# EAGLE design rgb_cube_control (EAGLE 5.11)
BOM: EXCLUDE; PARTNO: 114-00841-68

## Sheet 1 of 2
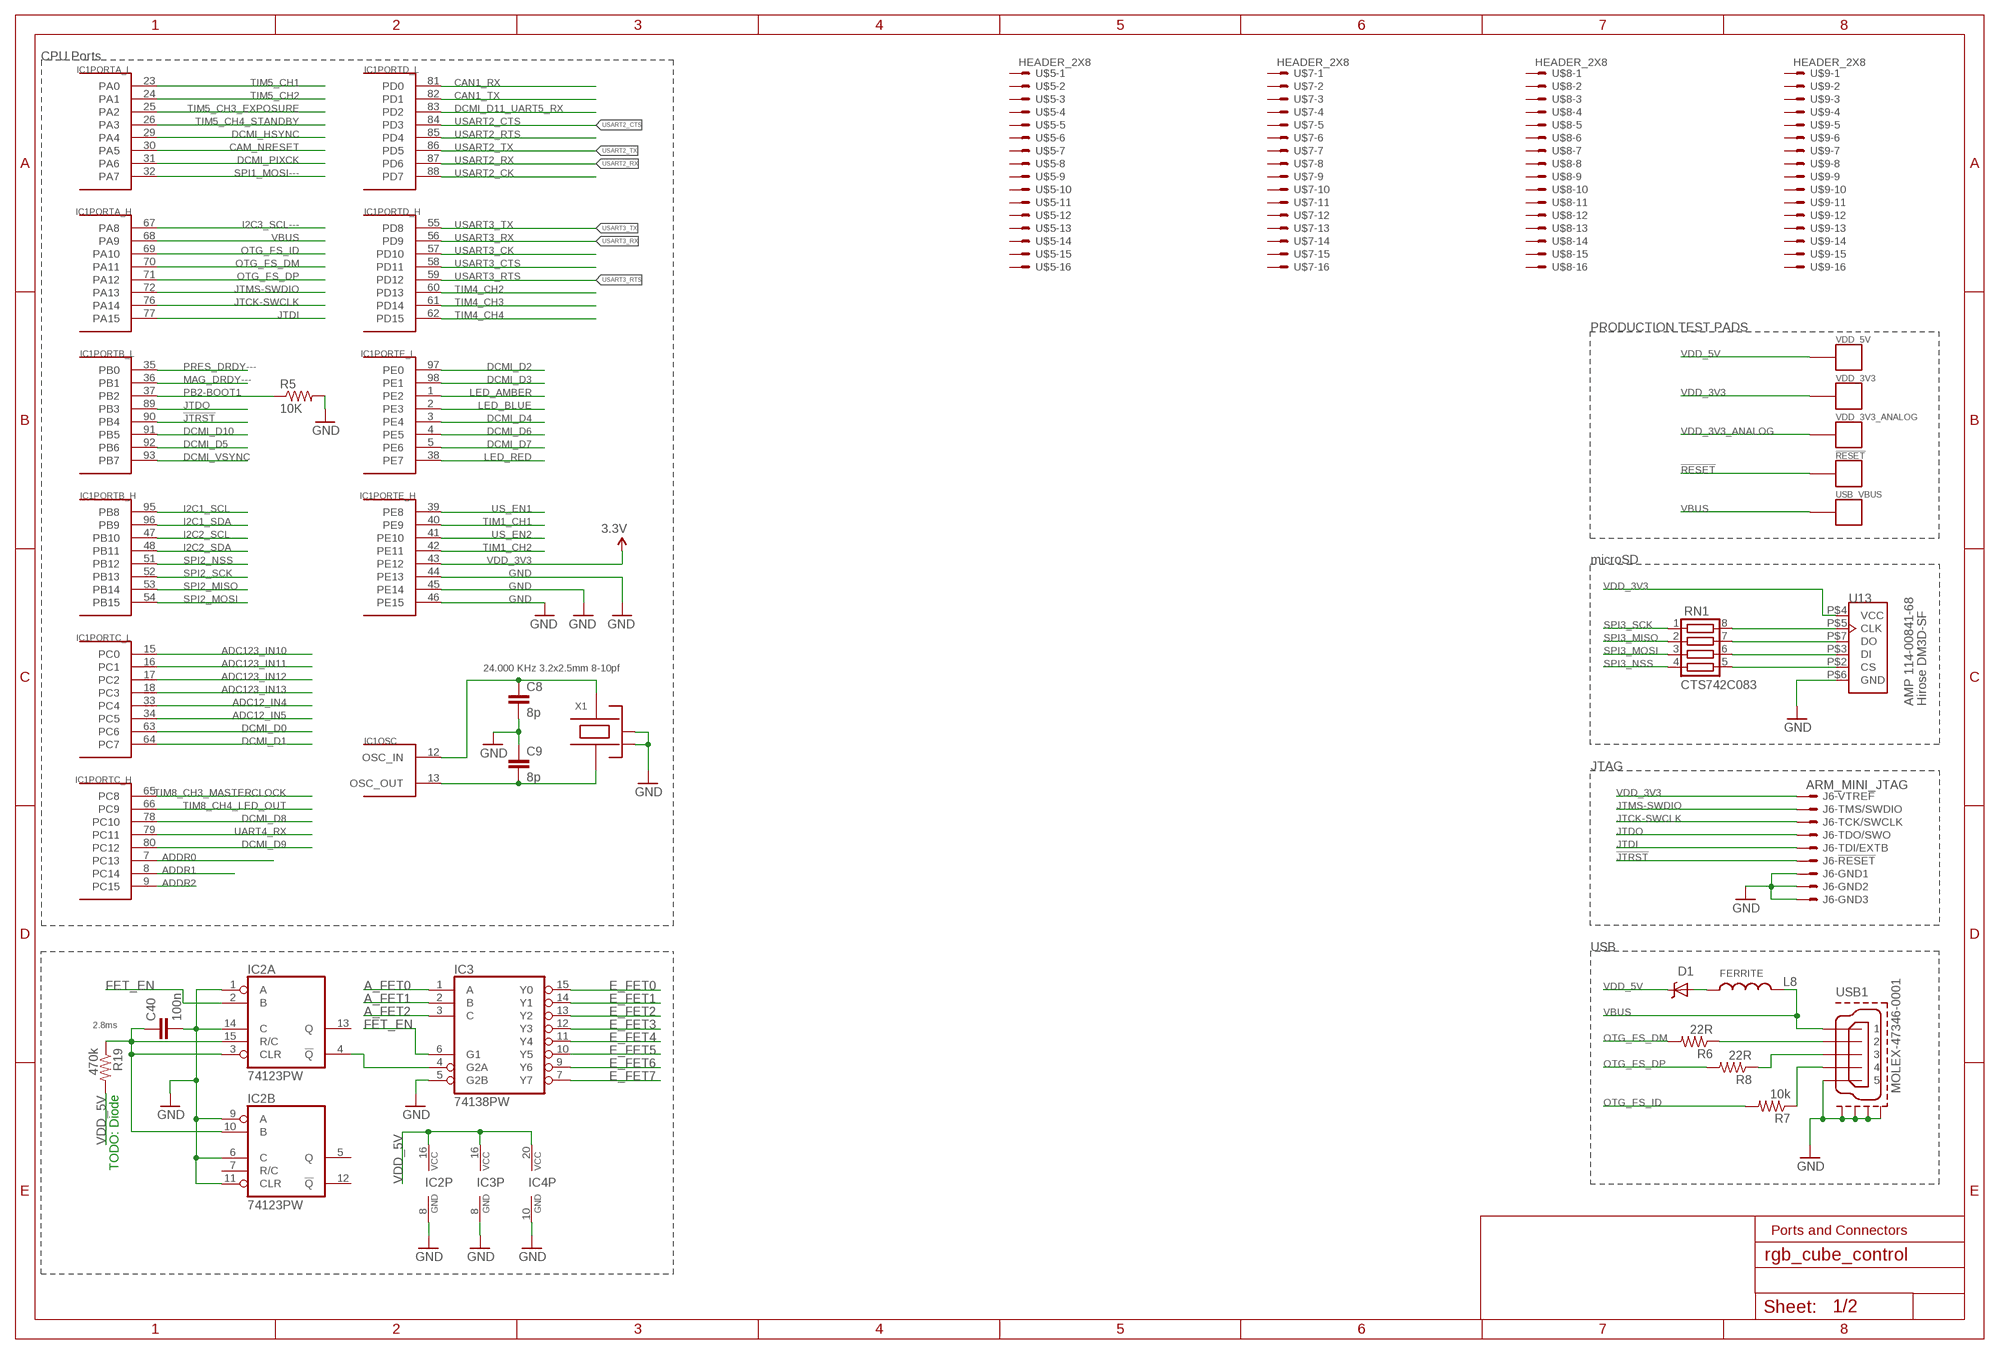
[diagram p0: schematic, sheet 1]

### Parts
!RESET  PAD.04  [PAD.04X.04]
C8  8p  CAP0402-CAP  [0402-CAP]
C9  8p  CAP0402-CAP  [0402-CAP]
C40  100n  C-EUC0402  [C0402]
D1  MSS1P4-M3  DIODE-SCHOTTKY_MSMP  [MICROSMP]
IC1  STM32F4X7VX  [TQFP100]
IC2  74123PW  [TSSOP-16]
IC3  74138PW  [TSSOP-16]
IC4  74540PW  [TSSOP-20]
J6  ARM_MINI_JTAG  ARM_MINI_JTAG-SMT  [FTSH-105-01-XXX-DV-K]
L8  FERRITE  INDUCTOR0402  [0402-IND]
R5  10K  RESISTOR0402-RES  [0402-RES]
R6  22R  RESISTOR0402-RES  [0402-RES]
R7  10k  RESISTOR0402-RES  [0402-RES]
R8  22R  RESISTOR0402-RES  [0402-RES]
R19  470k  RESISTOR  [0805]
RN1  CTS742C083  [CTS742C083]
U13  AMP 114-00841-68  SF-MICROSDAMP-114-00841-68  [AMPHENOL_114-00841-68]
U$5  HEADER_2X8  [HEADER_2MM_2X8]
U$7  HEADER_2X8  [HEADER_2MM_2X8]
U$8  HEADER_2X8  [HEADER_2MM_2X8]
U$9  HEADER_2X8  [HEADER_2MM_2X8]
USB1  MOLEX-47346-0001  [MOLEX-47346-0001]
USB_VBUS  PAD.04  [PAD.04X.04]
VDD_3V3  PAD.04  [PAD.04X.04]
VDD_3V3_ANALOG  PAD.04  [PAD.04X.04]
VDD_5V  PAD.04  [PAD.04X.04]
X1  24.000 KHz 3.2x2.5mm 8-10pf  OSCILLATOR-3.2X2.5  [OSCILLATOR-3.2X2.5]

### Nets
!JTRST: IC1.90(PORTB_L:PB4) J6.10
!RESET [power]: !RESET.P$1 ; also sheet 2
A_FET0: IC3.1(A)
A_FET1: IC3.2(B)
A_FET2: IC3.3(C)
ADC12_IN4: IC1.33(PORTC_L:PC4)
ADC12_IN5: IC1.34(PORTC_L:PC5)
ADC123_IN10: IC1.15(PORTC_L:PC0)
ADC123_IN11: IC1.16(PORTC_L:PC1)
ADC123_IN12: IC1.17(PORTC_L:PC2)
ADC123_IN13: IC1.18(PORTC_L:PC3)
ADDR0: IC1.7(PORTC_H:PC13)
ADDR1: IC1.8(PORTC_H:PC14)
ADDR2: IC1.9(PORTC_H:PC15)
CAM_NRESET: IC1.30(PORTA_L:PA5)
CAN1_RX: IC1.81(PORTD_L:PD0)
CAN1_TX: IC1.82(PORTD_L:PD1)
DCMI_D0: IC1.63(PORTC_L:PC6)
DCMI_D1: IC1.64(PORTC_L:PC7)
DCMI_D2: IC1.97(PORTE_L:PE0)
DCMI_D3: IC1.98(PORTE_L:PE1)
DCMI_D4: IC1.3(PORTE_L:PE4)
DCMI_D5: IC1.92(PORTB_L:PB6)
DCMI_D6: IC1.4(PORTE_L:PE5)
DCMI_D7: IC1.5(PORTE_L:PE6)
DCMI_D8: IC1.78(PORTC_H:PC10)
DCMI_D9: IC1.80(PORTC_H:PC12)
DCMI_D10: IC1.91(PORTB_L:PB5)
DCMI_D11_UART5_RX: IC1.83(PORTD_L:PD2)
DCMI_HSYNC: IC1.29(PORTA_L:PA4)
DCMI_PIXCK: IC1.31(PORTA_L:PA6)
DCMI_VSYNC: IC1.93(PORTB_L:PB7)
E_FET0: IC3.15(Y0)
E_FET1: IC3.14(Y1)
E_FET2: IC3.13(Y2)
E_FET3: IC3.12(Y3)
E_FET4: IC3.11(Y4)
E_FET5: IC3.10(Y5)
E_FET6: IC3.9(Y6)
E_FET7: IC3.7(Y7)
FET_EN: IC2.2(A:B) IC3.6(G1)
GND [power]: C8.2 C9.1 C40.2 IC1.44(PORTE_H:PE13) IC1.45(PORTE_H:PE14) IC1.46(PORTE_H:PE15) IC2.1(A:A) IC2.6(B:C) IC2.8(P:GND) IC2.9(B:A) IC2.11(B:CLR) IC2.14(A:C) IC3.5(G2B) IC3.8(GND) IC4.10(P:GND) J6.3 J6.5 J6.9 R5.2 U13.P$6(GND) USB1.GND USB1.GND1 USB1.GND2 USB1.GND3 USB1.GND4 X1.2(NC_2) X1.4(NC_4) ; also sheet 2
I2C1_SCL: IC1.95(PORTB_H:PB8)
I2C1_SDA: IC1.96(PORTB_H:PB9)
I2C2_SCL: IC1.47(PORTB_H:PB10)
I2C2_SDA: IC1.48(PORTB_H:PB11)
I2C3_SCL---: IC1.67(PORTA_H:PA8)
JTCK-SWCLK: IC1.76(PORTA_H:PA14) J6.4
JTDI: IC1.77(PORTA_H:PA15) J6.8
JTDO: IC1.89(PORTB_L:PB3) J6.6
JTMS-SWDIO: IC1.72(PORTA_H:PA13) J6.2
LED_AMBER: IC1.1(PORTE_L:PE2) ; also sheet 2
LED_BLUE: IC1.2(PORTE_L:PE3) ; also sheet 2
LED_RED: IC1.38(PORTE_L:PE7) ; also sheet 2
MAG_DRDY---: IC1.36(PORTB_L:PB1)
N$1: C9.2 IC1.13(OSC:OSC_OUT) X1.1
N$2: C8.1 IC1.12(OSC:OSC_IN) X1.3
N$21: RN1.5 U13.P$2(CS)
N$23 [power]: D1.ANODE(A) L8.1
N$26: RN1.6 U13.P$3(DI)
N$31: RN1.7 U13.P$7(DO)
N$32: RN1.8 U13.P$5(CLK)
N$45: IC2.4(A:!Q) IC3.4(G2A)
OTG_DM: R6.1 USB1.D-
OTG_DP: R8.1 USB1.D+
OTG_FS_DM: IC1.70(PORTA_H:PA11) R6.2
OTG_FS_DP: IC1.71(PORTA_H:PA12) R8.2
OTG_FS_ID: IC1.69(PORTA_H:PA10) R7.2
OTG_ID: R7.1 USB1.ID
PB2-BOOT1: IC1.37(PORTB_L:PB2) R5.1
PRES_DRDY---: IC1.35(PORTB_L:PB0)
SPI1_MOSI---: IC1.32(PORTA_L:PA7)
SPI2_MISO: IC1.53(PORTB_H:PB14)
SPI2_MOSI: IC1.54(PORTB_H:PB15)
SPI2_NSS: IC1.51(PORTB_H:PB12)
SPI2_SCK: IC1.52(PORTB_H:PB13)
SPI3_MISO: RN1.2
SPI3_MOSI: RN1.3
SPI3_NSS: RN1.4
SPI3_SCK: RN1.1
TIM1_CH1: IC1.40(PORTE_H:PE9)
TIM1_CH2: IC1.42(PORTE_H:PE11)
TIM4_CH2: IC1.60(PORTD_H:PD13)
TIM4_CH3: IC1.61(PORTD_H:PD14)
TIM4_CH4: IC1.62(PORTD_H:PD15)
TIM5_CH1: IC1.23(PORTA_L:PA0)
TIM5_CH2: IC1.24(PORTA_L:PA1)
TIM5_CH3_EXPOSURE: IC1.25(PORTA_L:PA2)
TIM5_CH4_STANDBY: IC1.26(PORTA_L:PA3)
TIM8_CH3_MASTERCLOCK: IC1.65(PORTC_H:PC8)
TIM8_CH4_LED_OUT: IC1.66(PORTC_H:PC9)
UART4_RX: IC1.79(PORTC_H:PC11)
US_EN1: IC1.39(PORTE_H:PE8)
US_EN2: IC1.41(PORTE_H:PE10)
USART2_CK: IC1.88(PORTD_L:PD7)
USART2_CTS: IC1.84(PORTD_L:PD3)
USART2_RTS: IC1.85(PORTD_L:PD4)
USART2_RX: IC1.87(PORTD_L:PD6)
USART2_TX: IC1.86(PORTD_L:PD5)
USART3_CK: IC1.57(PORTD_H:PD10)
USART3_CTS: IC1.58(PORTD_H:PD11)
USART3_RTS: IC1.59(PORTD_H:PD12)
USART3_RX: IC1.56(PORTD_H:PD9)
USART3_TX: IC1.55(PORTD_H:PD8)
VBUS [power]: IC1.68(PORTA_H:PA9) L8.2 USB1.VBUS USB_VBUS.P$1
VDD_3V3 [power]: IC1.43(PORTE_H:PE12) J6.1 U13.P$4(VCC) VDD_3V3.P$1 ; supply symbol labelled 3.3V ; also sheet 2
VDD_3V3_ANALOG [power]: VDD_3V3_ANALOG.P$1 ; also sheet 2
VDD_5V [power]: C40.1 D1.CATHODE(C) IC2.3(A:CLR) IC2.10(B:B) IC2.15(A:R/C) IC2.16(P:VCC) IC3.16(VCC) IC4.20(P:VCC) R19.1 R19.2 VDD_5V.P$1 ; also sheet 2
Unconnected: IC2.5(B:Q) IC2.7(B:R/C) IC2.12(B:!Q) IC2.13(A:Q) IC4.1(:G1) IC4.2(:A1) IC4.3(:A2) IC4.4(:A3) IC4.5(:A4) IC4.6(:A5) IC4.7(:A6) IC4.8(:A7) IC4.9(:A8) IC4.11(:Y8) IC4.12(:Y7) IC4.13(:Y6) IC4.14(:Y5) IC4.15(:Y4) IC4.16(:Y3) IC4.17(:Y2) IC4.18(:Y1) IC4.19(:G2) U$5.1 U$5.2 U$5.3 U$5.4 U$5.5 U$5.6 U$5.7 U$5.8 U$5.9 U$5.10 U$5.11 U$5.12 U$5.13 U$5.14 U$5.15 U$5.16 U$7.1 U$7.2 U$7.3 U$7.4 U$7.5 U$7.6 U$7.7 U$7.8 U$7.9 U$7.10 U$7.11 U$7.12 U$7.13 U$7.14 U$7.15 U$7.16 U$8.1 U$8.2 U$8.3 U$8.4 U$8.5 U$8.6 U$8.7 U$8.8 U$8.9 U$8.10 U$8.11 U$8.12 U$8.13 U$8.14 U$8.15 U$8.16 U$9.1 U$9.2 U$9.3 U$9.4 U$9.5 U$9.6 U$9.7 U$9.8 U$9.9 U$9.10 U$9.11 U$9.12 U$9.13 U$9.14 U$9.15 U$9.16

### Notes on the sheet
- CPU Ports
- PRODUCTION TEST PADS
- microSD
- Hirose DM3D-SF
- JTAG
- USB
- 2.8ms
- TODO: Diode
- Ports and Connectors

## Sheet 2 of 2
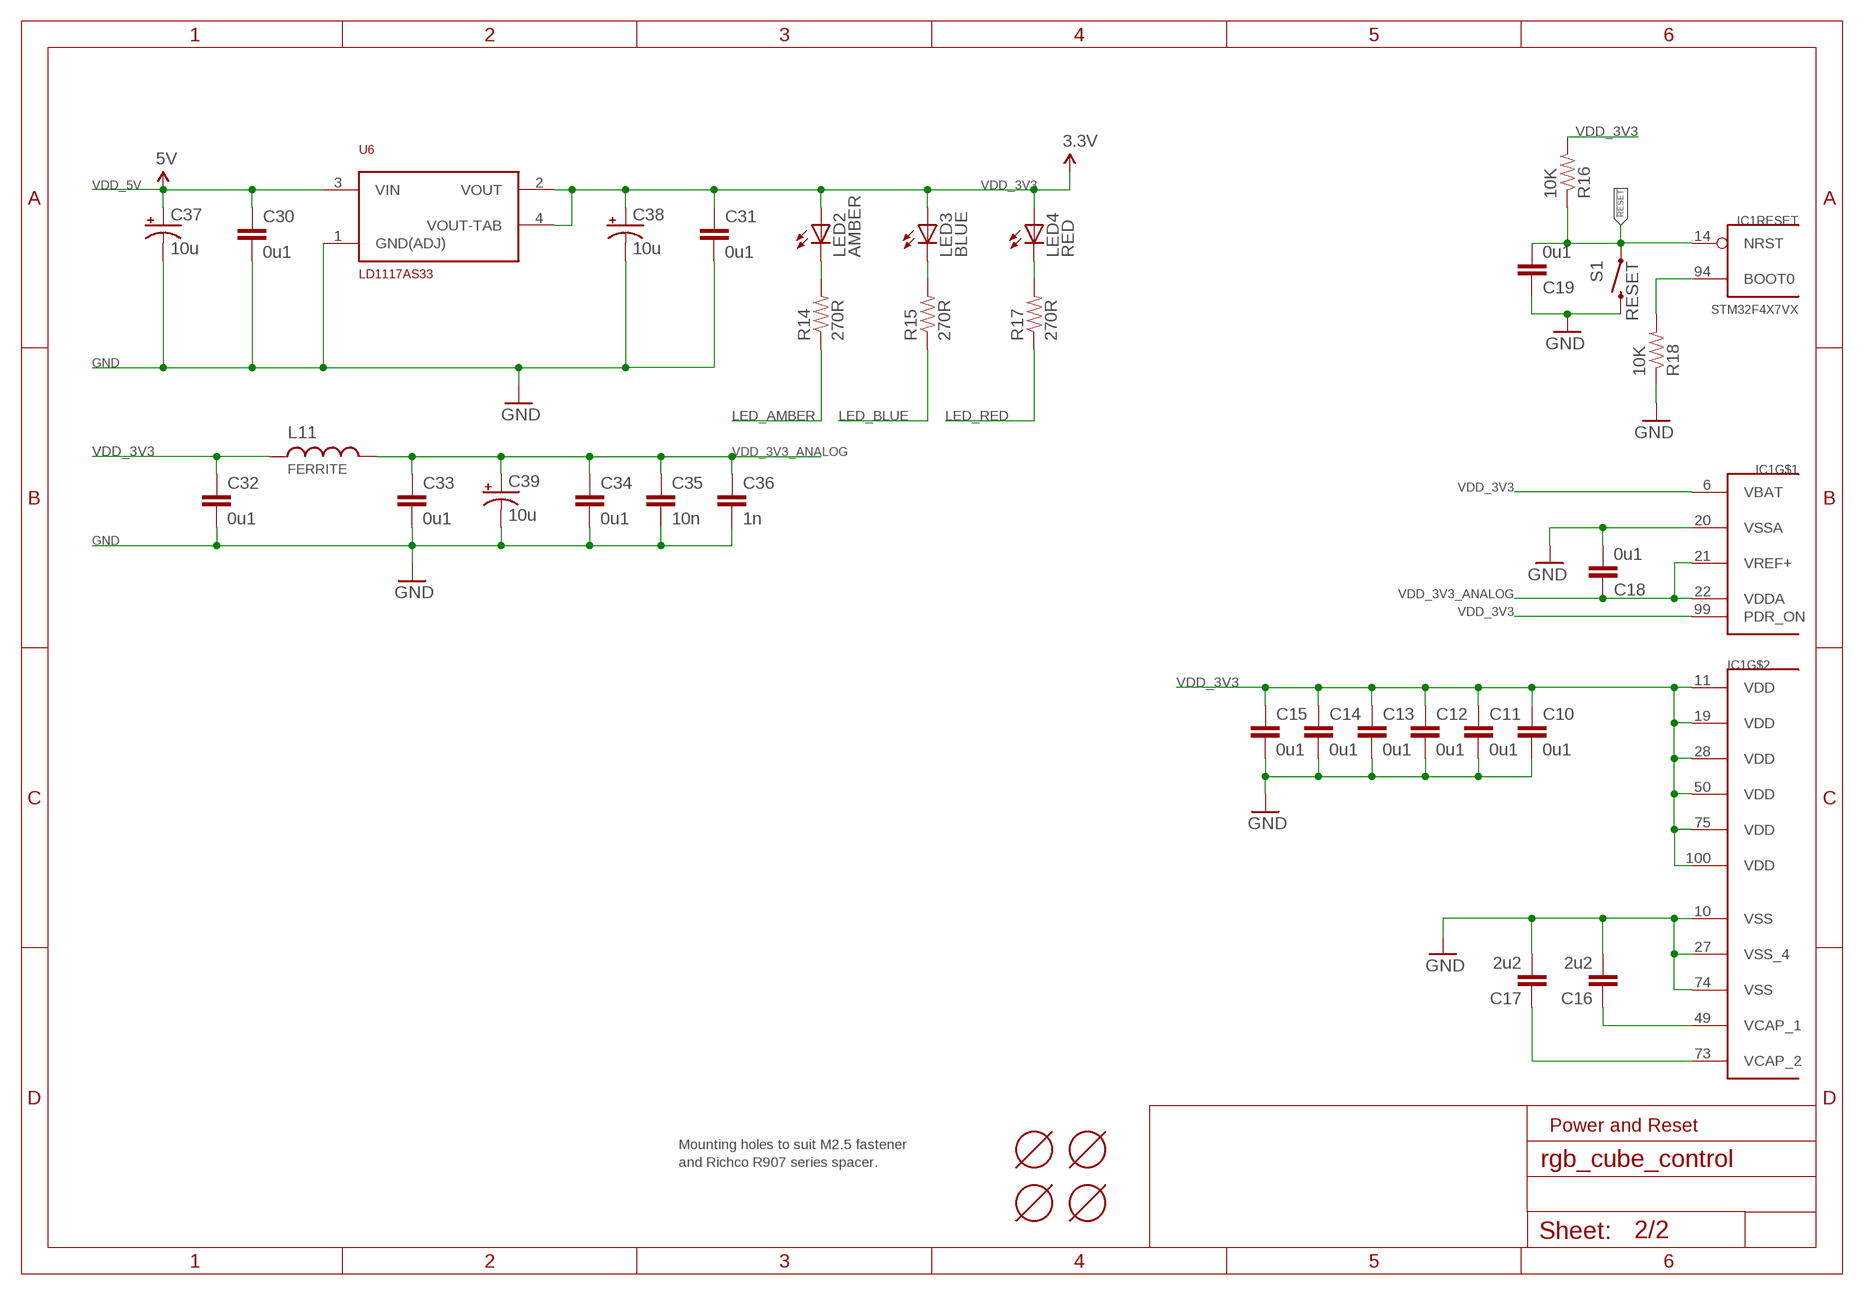
[diagram p1: schematic, sheet 2]

### Parts
C10  0u1  CAP0402-CAP  [0402-CAP]
C11  0u1  CAP0402-CAP  [0402-CAP]
C12  0u1  CAP0402-CAP  [0402-CAP]
C13  0u1  CAP0402-CAP  [0402-CAP]
C14  0u1  CAP0402-CAP  [0402-CAP]
C15  0u1  CAP0402-CAP  [0402-CAP]
C16  2u2  CAP0402-CAP  [0402-CAP]
C17  2u2  CAP0402-CAP  [0402-CAP]
C18  0u1  CAP0402-CAP  [0402-CAP]
C19  0u1  CAP0402-CAP  [0402-CAP]
C30  0u1  CAP0402-CAP  [0402-CAP]
C31  0u1  CAP0402-CAP  [0402-CAP]
C32  0u1  CAP0402-CAP  [0402-CAP]
C33  0u1  CAP0402-CAP  [0402-CAP]
C34  0u1  CAP0402-CAP  [0402-CAP]
C35  10n  CAP0402-CAP  [0402-CAP]
C36  1n  CAP0402-CAP  [0402-CAP]
C37  10u  CAP_POL1206  [EIA3216]
C38  10u  CAP_POL1206  [EIA3216]
C39  10u  CAP_POL1206  [EIA3216]
L11  FERRITE  INDUCTOR0402  [0402-IND]
LED2  AMBER  LED0603  [LED-0603]
LED3  BLUE  LED0603  [LED-0603]
LED4  RED  LED0603  [LED-0603]
R14  270R  RESISTOR0402-RES  [0402-RES]
R15  270R  RESISTOR0402-RES  [0402-RES]
R16  10K  RESISTOR0402-RES  [0402-RES]
R17  270R  RESISTOR0402-RES  [0402-RES]
R18  10K  RESISTOR0402-RES  [0402-RES]
S1  RESET  SWITCH-MOMENTARY-2  [EVQP7J01K]
U6  LD1117AS33  [SOT-223]
U$1  MOUNT-HOLE2.6MM  [MOUNT-HOLE2.6]
U$2  MOUNT-HOLE2.6MM  [MOUNT-HOLE2.6]
U$3  MOUNT-HOLE2.6MM  [MOUNT-HOLE2.6]
U$4  MOUNT-HOLE2.6MM  [MOUNT-HOLE2.6]

### Nets
!RESET [power]: C19.2 IC1.14(RESET:NRST) R16.1 S1.A1 ; also sheet 1
BOOT0: IC1.94(RESET:BOOT0) R18.2
GND [power]: C10.2 C11.2 C12.2 C13.2 C14.2 C15.2 C16.2 C17.2 C18.2 C19.1 C30.2 C31.2 C32.2 C33.2 C34.2 C35.2 C36.2 C37.C(-) C38.C(-) C39.C(-) IC1.10(VSS) IC1.20(VSSA) IC1.27(VSS_4) IC1.74(VSS) R18.1 S1.B3 U6.1(GND(ADJ)) ; also sheet 1
LED_AMBER: R14.1 ; also sheet 1
LED_BLUE: R15.1 ; also sheet 1
LED_RED: R17.1 ; also sheet 1
N$8: LED4.C R17.2
N$28: LED3.C R15.2
N$30: LED2.C R14.2
VCAP_1: C16.1 IC1.49(VCAP_1)
VCAP_2: C17.1 IC1.73(VCAP_2)
VDD_3V3 [power]: C10.1 C11.1 C12.1 C13.1 C14.1 C15.1 C31.1 C32.1 C38.A(+) IC1.6(VBAT) IC1.11(VDD) IC1.19(VDD) IC1.28(VDD) IC1.50(VDD) IC1.75(VDD) IC1.99(PDR_ON) IC1.100(VDD) L11.1 LED2.A LED3.A LED4.A R16.2 U6.2(VOUT) U6.4(VOUT-TAB) ; supply symbol labelled 3.3V ; also sheet 1
VDD_3V3_ANALOG [power]: C18.1 C33.1 C34.1 C35.1 C36.1 C39.A(+) IC1.21(VREF+) IC1.22(VDDA) L11.2 ; also sheet 1
VDD_5V [power]: C30.1 C37.A(+) U6.3(VIN) ; supply symbol labelled 5V ; also sheet 1

### Notes on the sheet
- Power and Reset
- Mounting holes to suit M2.5 fastener
- and Richco R907 series spacer.

## Library data of the parts
!RESET USB_VBUS VDD_3V3 VDD_3V3_ANALOG VDD_5V = pixhawk2:PAD: Test pad This footprint includes three classes: The actual test pads, a pogo-pin footprint to mount the pogo-pin as through-hole part and a hole footprint which allows the head of the pogo-pin to pass through (do NOT use the hole to mount the pogo-pin). In a typical test setup, the stack would consist of three PCBs: The actual PCB under testing with a test pad on the bottom, then a second PCB with the hole for the pogo-pin head where the PCB under testing is pressed on and a third PCB at 30 mm / 1.2" distance with the pogo-pin footprints. The pogo-pins are soldered to the last PCB. To create the stack, copy the board under testing and exchange the footprints - this way the correct positioning is ensured.
C8-C19 C30-C36 = pixhawk2:CAP: Capacitor Standard 0603 ceramic capacitor, and 0.1" leaded capacitor.
C37-C39 = pixhawk2:CAP_POL: Capacitor Polarized These are standard SMD and PTH capacitors. Normally 10uF, 47uF, and 100uF in electrolytic and tantalum varieties. Always verify the external diameter of the through hole cap, it varies with capacity, voltage, and manufacturer. The EIA devices should be standard.
C40 = resistor:C-EU: CAPACITOR, European symbol
D1 = pixhawk2:DIODE-SCHOTTKY: Schottky barrier diode in DO214AC, e.g. Fairchild SS14.
IC1 = pixhawk2:STM32F4X7VX: STM32F4X7VX 100 pin LQFP STM32F407VE - 512 KB flash, no crypto STM32F407VG - 1 MB flash, no crypto STM32F417VE - 512 KB flash, with crypto STM32F417VG - 1 MB flash, with crypto
IC2 = rgb_cube:74123
IC3 = rgb_cube:74*138: 3-line to 8-line DECODER/DEMULTIPLEXER
IC4 = rgb_cube:74540
J6 = pixhawk2:ARM_MINI_JTAG: CONNECTOR wire to board 1.25 mm (.049 inch) pitch header
L8 L11 = pixhawk2:INDUCTOR: Inductors Basic Inductor/Choke - 0603 and 1206. Footprints are not proven and vary greatly between part numbers.
LED2-LED4 = pixhawk2:LED: LEDs Standard schematic elements and footprints for 5mm, 3mm, 1206, and 0603 sized LEDs. 5mm - Spark Fun Electronics SKU : COM-00529 (and others)
R5-R8 R14-R18 = pixhawk2:RESISTOR: Resistor Basic schematic elements and footprints for 0603, 1206, and PTH 1/10th watt (small) resistors.
R19 = rgb_cube:RESISTOR: Resistor Basic schematic elements and footprints for 0603, 1206, and PTH 1/10th watt (small) resistors.
RN1 = pixhawk2:CTS742C083: Chip Resistor Array 4 Single Resistor Source: http://www.ctscorp.com/components/Datasheets/CTSChipArrayDs.pdf; OC_FARNELL: unknown; OC_NEWARK: unknown
S1 = pixhawk2:SWITCH-MOMENTARY-2
U6 = pixhawk2:LD1117A: LD1117A LDO Datasheet: http://www.st.com/stonline/books/pdf/docs/7194.pdf
U13 = pixhawk2:SF-MICROSD
U$1-U$4 = pixhawk2:MOUNT-HOLE
U$5 U$7-U$9 = rgb_cube:HEADER_2X8
USB1 = rgb_cube:MOLEX-47346-0001: MICRO USB B, BOTTOM MOUNT
X1 = pixhawk2:OSCILLATOR: Crystal Oscillator in 3.2x2.5 SMD

## Net classes
0 signal: width 0.203 mm, drill 0.3 mm, clearance 0.203 mm
1 power: width 0.254 mm, drill 0.3 mm, clearance 0.203 mm

## Board
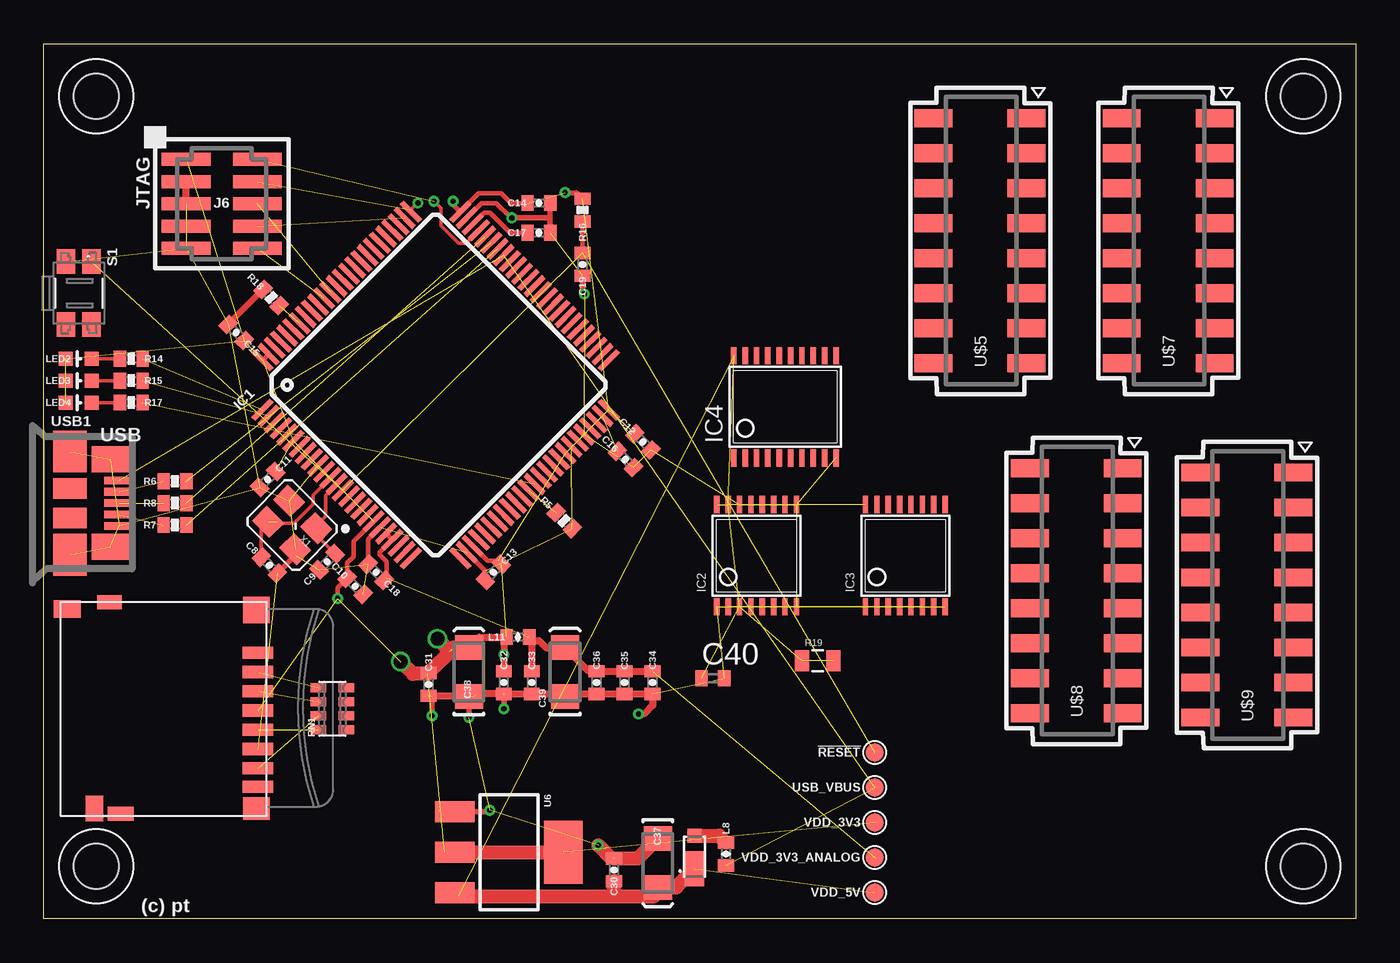
[diagram p2: board, top side]
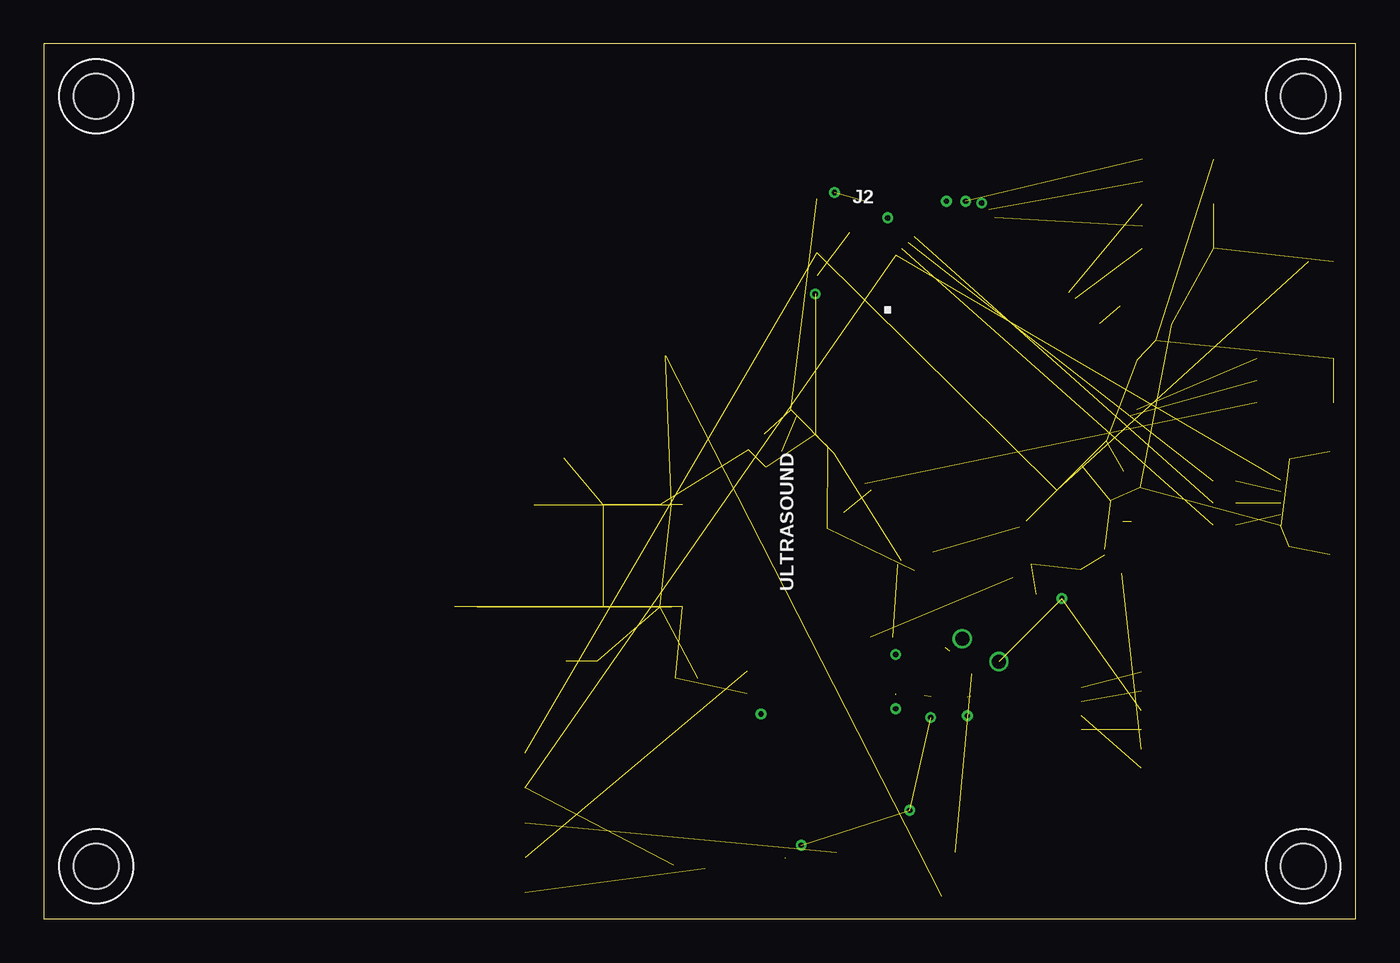
[diagram p3: board, bottom side, seen from below]

Size 75 x 50 mm. Coordinates in mm from the lower left corner, seen from the top.
Outline: 0,50 75,50 75,0 0,0 0,50
Copper layers (1*16): Top 0.035mm / dielectric 1.5mm / Bottom 0.035mm
Design rules "multi-cb_035um-cu *": minimum track width 6mil, minimum drill 12mil, track to track 6mil, track to pad 6mil, pad to pad 6mil, via to via 6mil, smd to smd 6mil, copper to edge 20mil, drill to drill 8mil, minimum pad ring 8mil, minimum via ring 6mil, stop-mask expansion 3mil, vias tented up to drill 0mil, thermal gap 8mil

### Footprints (pad centres in the part's own frame; a part is rotated, then mirrored left to right if it is on the bottom)
PAD.04X.04 = smd 1.016 x 1.016: P$1 0,0
0402-CAP = smd 0.7 x 0.9: 1 -0.65,0; 2 0.65,0
EIA3216 = smd 1.4 x 1.6: A 1.4,0; C -1.4,0
C0402 = smd 0.7 x 0.9: 1 -0.65,0; 2 0.65,0
MICROSMP = smd 0.8 x 0.8: ANODE 0.65,0 | smd 2 x 1.1: CATHODE -1.25,0
TQFP100 = smd 1.5 x 0.29: 1 -8,6; 2 -8,5.5; 3 -8,5; 4 -8,4.5; 5 -8,4; 6 -8,3.5; 7 -8,3; 8 -8,2.5; 9 -8,2; 10 -8,1.5; 11 -8,1; 12 -8,0.5; 13 -8,0; 14 -8,-0.5; 15 -8,-1; 16 -8,-1.5; 17 -8,-2; 18 -8,-2.5; 19 -8,-3; 20 -8,-3.5; 21 -8,-4; 22 -8,-4.5; 23 -8,-5; 24 -8,-5.5; 25 -8,-6; 51 8,-6; 52 8,-5.5; 53 8,-5; 54 8,-4.5; 55 8,-4; 56 8,-3.5; 57 8,-3; 58 8,-2.5; 59 8,-2; 60 8,-1.5; 61 8,-1; 62 8,-0.5; 63 8,0; 64 8,0.5; 65 8,1; 66 8,1.5; 67 8,2; 68 8,2.5; 69 8,3; 70 8,3.5; 71 8,4; 72 8,4.5; 73 8,5; 74 8,5.5; 75 8,6 | smd 0.29 x 1.5: 26 -6,-8; 27 -5.5,-8; 28 -5,-8; 29 -4.5,-8; 30 -4,-8; 31 -3.5,-8; 32 -3,-8; 33 -2.5,-8; 34 -2,-8; 35 -1.5,-8; 36 -1,-8; 37 -0.5,-8; 38 0,-8; 39 0.5,-8; 40 1,-8; 41 1.5,-8; 42 2,-8; 43 2.5,-8; 44 3,-8; 45 3.5,-8; 46 4,-8; 47 4.5,-8; 48 5,-8; 49 5.5,-8; 50 6,-8; 76 6,8; 77 5.5,8; 78 5,8; 79 4.5,8; 80 4,8; 81 3.5,8; 82 3,8; 83 2.5,8; 84 2,8; 85 1.5,8; 86 1,8; 87 0.5,8; 88 0,8; 89 -0.5,8; 90 -1,8; 91 -1.5,8; 92 -2,8; 93 -2.5,8; 94 -3,8; 95 -3.5,8; 96 -4,8; 97 -4.5,8; 98 -5,8; 99 -5.5,8; 100 -6,8
TSSOP-16 = smd 0.305 x 0.991: 1 -2.275,-2.918; 2 -1.625,-2.918; 3 -0.975,-2.918; 4 -0.325,-2.918; 5 0.325,-2.918; 6 0.975,-2.918; 7 1.625,-2.918; 8 2.275,-2.918; 9 2.275,2.918; 10 1.625,2.918; 11 0.975,2.918; 12 0.325,2.918; 13 -0.325,2.918; 14 -0.975,2.918; 15 -1.625,2.918; 16 -2.275,2.918
TSSOP-20 = smd 0.305 x 0.991: 1 -2.305,-2.918; 2 -1.655,-2.918; 3 -1.005,-2.918; 4 -0.355,-2.918; 5 0.295,-2.918; 6 0.945,-2.918; 7 1.595,-2.918; 8 2.245,-2.918; 9 2.895,-2.918; 10 3.545,-2.918; 11 3.545,2.918; 12 2.895,2.918; 13 2.245,2.918; 14 1.595,2.918; 15 0.945,2.918; 16 0.295,2.918; 17 -0.355,2.918; 18 -1.005,2.918; 19 -1.655,2.918; 20 -2.305,2.918
FTSH-105-01-XXX-DV-K = smd 0.737 x 2.794: 1 -2.54,-2.032; 2 -2.54,2.032; 3 -1.27,-2.032; 4 -1.27,2.032; 5 0,-2.032; 6 0,2.032; 7 1.27,-2.032; 8 1.27,2.032; 9 2.54,-2.032; 10 2.54,2.032
0402-IND = smd 0.7 x 0.9: 1 -0.65,0; 2 0.65,0
LED-0603 = smd 0.8 x 0.8: A 0,-0.75; C 0,0.75
0402-RES = smd 0.7 x 0.9: 1 -0.65,0; 2 0.65,0
0805 = smd 0.8 x 1.2: 1 -0.9,0; 2 0.9,0
CTS742C083 = smd 0.5 x 0.9: 1 -1.2,-0.8; 2 -0.4,-0.8; 3 0.4,-0.8; 4 1.2,-0.8; 5 1.2,0.8; 6 0.4,0.8; 7 -0.4,0.8; 8 -1.2,0.8
EVQP7J01K = smd 1.4 x 1.05: A1 -1.8,0.725; A2 1.8,0.725; B3 -1.8,-0.725; B4 1.8,-0.725
SOT-223 = smd 1.219 x 2.235: 1 -2.311,-3.099; 2 0,-3.099; 3 2.311,-3.099 | smd 3.6 x 2.2: 4 0,3.099
AMPHENOL_114-00841-68 = smd 0.7 x 1.75: P$1 7.7,-1; P$2 6.6,-1; P$3 5.5,-1; P$4 4.4,-1; P$5 3.3,-1; P$6 2.2,-1; P$7 1.1,-1; P$8 0.04,-1 | smd 1.5 x 1.5: P$9 10.15,-0.9 | smd 1.3 x 1.5: P$10 -1.2,-0.9 | smd 0.8 x 1.5: P$11 -1.5,6.85 | smd 1.45 x 1: P$12 -1.2,8.35 | smd 0.8 x 1.4: P$13 10.6,7.5 | smd 1 x 1.55: P$14 10.2,9.9
MOUNT-HOLE2.6 = hole 2.6: 0,0
HEADER_2MM_2X8 = smd 1.02 x 2.16: 1 7,-2.925; 2 7,2.385; 3 5,-2.925; 4 5,2.385; 5 3,-2.925; 6 3,2.385; 7 1,-2.925; 8 1,2.385; 9 -1,-2.925; 10 -1,2.385; 11 -3,-2.925; 12 -3,2.385; 13 -5,-2.925; 14 -5,2.385; 15 -7,-2.925; 16 -7,2.385
MOLEX-47346-0001 = smd 1.7 x 0.44: D+ 2.8,0; D- 2.8,0.65; GND 2.8,-1.3; ID 2.8,-0.65; VBUS 2.8,1.3 | smd 1.9 x 2.375: GND1 0,2.95; GND4 0,-2.95 | smd 2.1 x 1.475: GND2 2.3,2.5; GND3 2.3,-2.5 | smd 1.9 x 1.175: GND5 0,-0.838; GND6 0,0.838
OSCILLATOR-3.2X2.5 = smd 1.4 x 1.2: 1 -1.1,-0.85; 2 1.1,-0.85; 3 1.1,0.85; 4 -1.1,0.85

### Placement (x,y rotation side)
!RESET  47.5,9.5 180 top
C8  12.9,20.2 315 top
C9  16.2,20.4 45 top
C10  17.8,19 315 top
C11  12.8,25.1 225 top
C12  34.25,27.25 315 top
C13  25.7,19.8 225 top
C14  28.3,40.9 0 top
C15  11,33.5 135 top
C16  33.25,26.25 315 top
C17  28.3,39.2 0 top
C18  19,19.8 135 top
C19  30.8,37.4 90 top
C30  32.6,2.8 90 top
C31  22,13.4 270 top
C32  26.3,13.5 270 top
C33  27.9,13.5 270 top
C34  34.8,13.5 270 top
C35  33.2,13.5 270 top
C36  31.6,13.5 270 top
C37  35.1,3.2 270 top
C38  24.3,14.1 90 top
C39  29.8,14.1 90 top
C40  38.25,13.75 0 top
D1  37.2,4.1 90 top
IC1  22.4,30.5 45 top
IC2  40.75,20.75 0 top
IC3  49.25,20.75 0 top
IC4  41.75,29.25 0 top
J6  10.18,40.85 270 top
L8  39,3.7 270 top
L11  27.1,16.1 0 top
LED2  2,32 270 top
LED3  2,30.75 270 top
LED4  2,29.5 270 top
R5  29.75,22.75 315 top
R6  7.5,25 0 top
R7  7.5,22.5 0 top
R8  7.5,23.75 0 top
R14  5,32 180 top
R15  5,30.75 180 top
R16  30.8,40.5 90 top
R17  5,29.5 180 top
R18  13,35.5 315 top
R19  44.25,14.75 0 top
RN1  16.5,12 90 top
S1  2,35.75 270 top
U6  26.6,3.8 270 top
U13  11.25,7.5 90 top
U$1  72,3 0 top
U$2  72,47 0 top
U$3  3,47 0 top
U$4  3,3 0 top
U$5  53.25,38.75 90 top
U$7  64,38.75 90 top
U$8  58.75,18.75 90 top
U$9  68.5,18.5 90 top
USB1  1.5,23.75 0 top
USB_VBUS  47.5,7.5 180 top
VDD_3V3  47.5,5.5 180 top
VDD_3V3_ANALOG  47.5,3.5 180 top
VDD_5V  47.5,1.5 180 top
X1  14.2,22.5 135 top

### Tracks (layer width: path | path; a pad name or v marks a point on that pad's centre or on a via)
!JTRST  (1 unrouted)
!RESET  (3 unrouted)
  Top 0.254: C19.2 R16.1
BOOT0  (1 unrouted)
FET_EN  (1 unrouted)
GND  (via drill 0.31)  (42 unrouted)
  Top 0.254: IC1.27 25.24,19.88 C13.2 | IC1.74 25.02,40.9 25.85,40.9 26.7,40.05 v26.75,40.05 | IC1.20 18.54,21.69 C18.2
  Top 0.305: v30.9,35.7 30.8,35.8 C19.1 | C8.2 14.38,20.76 X1.4 | 28.95,40.05 C14.2 | v24.3,11.5 C38.C | U6.1 25.41,6.11 v25.5,6.2 | 28.95,40.05 C17.2 | v26.75,40.05 28.95,40.05 | C15.2 R18.1 | 32.4,3.5 32.6,3.5 | v22.2,11.6 22.2,12.7 | v26.3,12 26.3,12.8
  Top 0.406: C31.2 24.65,12.75 24.8,12.9 26.25,12.9 C32.2 C33.2 29.65,12.85 C39.C 29.95,12.85 C36.2 C35.2 C34.2 34.8,12.2 34.3,11.7 v34,11.7 | 33.95,3.45 34,3.5 | J6.5 J6.3
  Top 0.8: C30.2 33.95,3.45 | 34,3.5 C37.C | v31.7,4.2 32.4,3.5
JTCK-SWCLK  (via drill 0.31)  (1 unrouted)
  Top 0.203: IC1.76 20.99,40.5 v21.39,40.9
JTDI  (1 unrouted)
JTDO  (1 unrouted)
JTMS-SWDIO  (via drill 0.31)  (1 unrouted)
  Top 0.203: IC1.72 24.14,38.6 23.7,38.6 22.7,39.6 22.7,40.6 v22.3,41
LED_AMBER  (1 unrouted)
LED_BLUE  (1 unrouted)
LED_RED  (1 unrouted)
N$1
  Top 0.203: IC1.13 16.1,24.2 16.1,23 15.58,22.48 X1.1 15.58,21.94 C9.2
N$2  (1 unrouted)
  Top 0.203: IC1.12 15.4,24.21 15.4,23.7 14.3,22.6 13.4,22.6 13.32,22.68 | X1.3 12.44,22.3 C8.1
N$8
  Top 0.203: R17.2 LED4.C
N$21  (1 unrouted)
N$23
  Top 0.8: L8.1 38.6,4.75 D1.ANODE
N$26  (1 unrouted)
N$28
  Top 0.203: R15.2 LED3.C
N$30
  Top 0.203: R14.2 LED2.C
N$31  (1 unrouted)
N$32  (1 unrouted)
N$45  (1 unrouted)
OTG_DM  (1 unrouted)
OTG_DP  (1 unrouted)
OTG_FS_DM  (1 unrouted)
OTG_FS_DP  (1 unrouted)
OTG_FS_ID  (1 unrouted)
OTG_ID  (1 unrouted)
PB2-BOOT1  (1 unrouted)
VBUS  (3 unrouted)
VCAP_1  (1 unrouted)
VCAP_2
  Top 0.254: IC1.73 25.18,40.35 25.5,40.35 26.65,39.2 C17.1
VDD_3V3  (via drill 0.31, 0.8)  (20 unrouted)
  Top 0.254: IC1.28 25.37,20.46 25.96,20.46 C13.1 | IC1.19 17.7,21.56 17.7,20.7 17.34,20.34 C10.1 16.8,18.93 v16.8,18.3 | IC1.100 IC1.99 | C14.1 26.7,40.9 26.15,41.45 24.86,41.45 IC1.75 23.4,40.81 v23.4,41
  Top 0.3: v29.8,41.5 30.45,41.5 R16.2
  Top 0.406: 23.45,15.5 C38.A 24.9,16.1 L11.1 26.3,15.95 v26.3,15.1 C32.1 | 23.15,3.8 U6.2 22.9,3.8 | U6.4 29.3,4.2 28.9,3.8 | C31.1 21.95,14
  Top 0.8: C31.1 23.45,15.5 | U6.2 28.9,3.8 | 21.95,14 21.1,14 v20.4,14.7 | v22.5,16 23.2,15.3
VDD_3V3_ANALOG  (2 unrouted)
  Top 0.254: IC1.21 IC1.22 19.2,20.94 19.2,20.8 19.6,20.4 19.6,19.48
  Top 0.305: C18.1 19.6,19.48
  Top 0.406: 27.9,15.95 L11.2 | C33.1 27.9,15.95 | 27.9,15.95 27.95,15.9 28.3,15.9 28.7,15.5 C39.A 31.15,14.15 C36.1 C35.1 C34.1
VDD_5V  (10 unrouted)
  Top 0.305: C37.A 35.1,1.5 34.9,1.3
  Top 0.406: U6.3 23.69,1.3
  Top 0.8: 23.69,1.3 32.6,1.3 | 32.6,1.3 34.9,1.3 | 32.6,1.3 C30.1 | D1.CATHODE 36.15,1.8 C37.A

### Text on the board
tPlace: JTAG | USB | (c) pt
bPlace: J2 | . | ULTRASOUND
tDocu: 5.0V
bDocu: 5.0V | 3.3V | 3.3V from UART | 2 | 1 | I2C Address | 0